# EAGLE design Adafruit Si5351A (EAGLE 6.2)
COMPANY: ADAFRUIT INDUSTRIES; DRAWN: KTOWN; REV: B
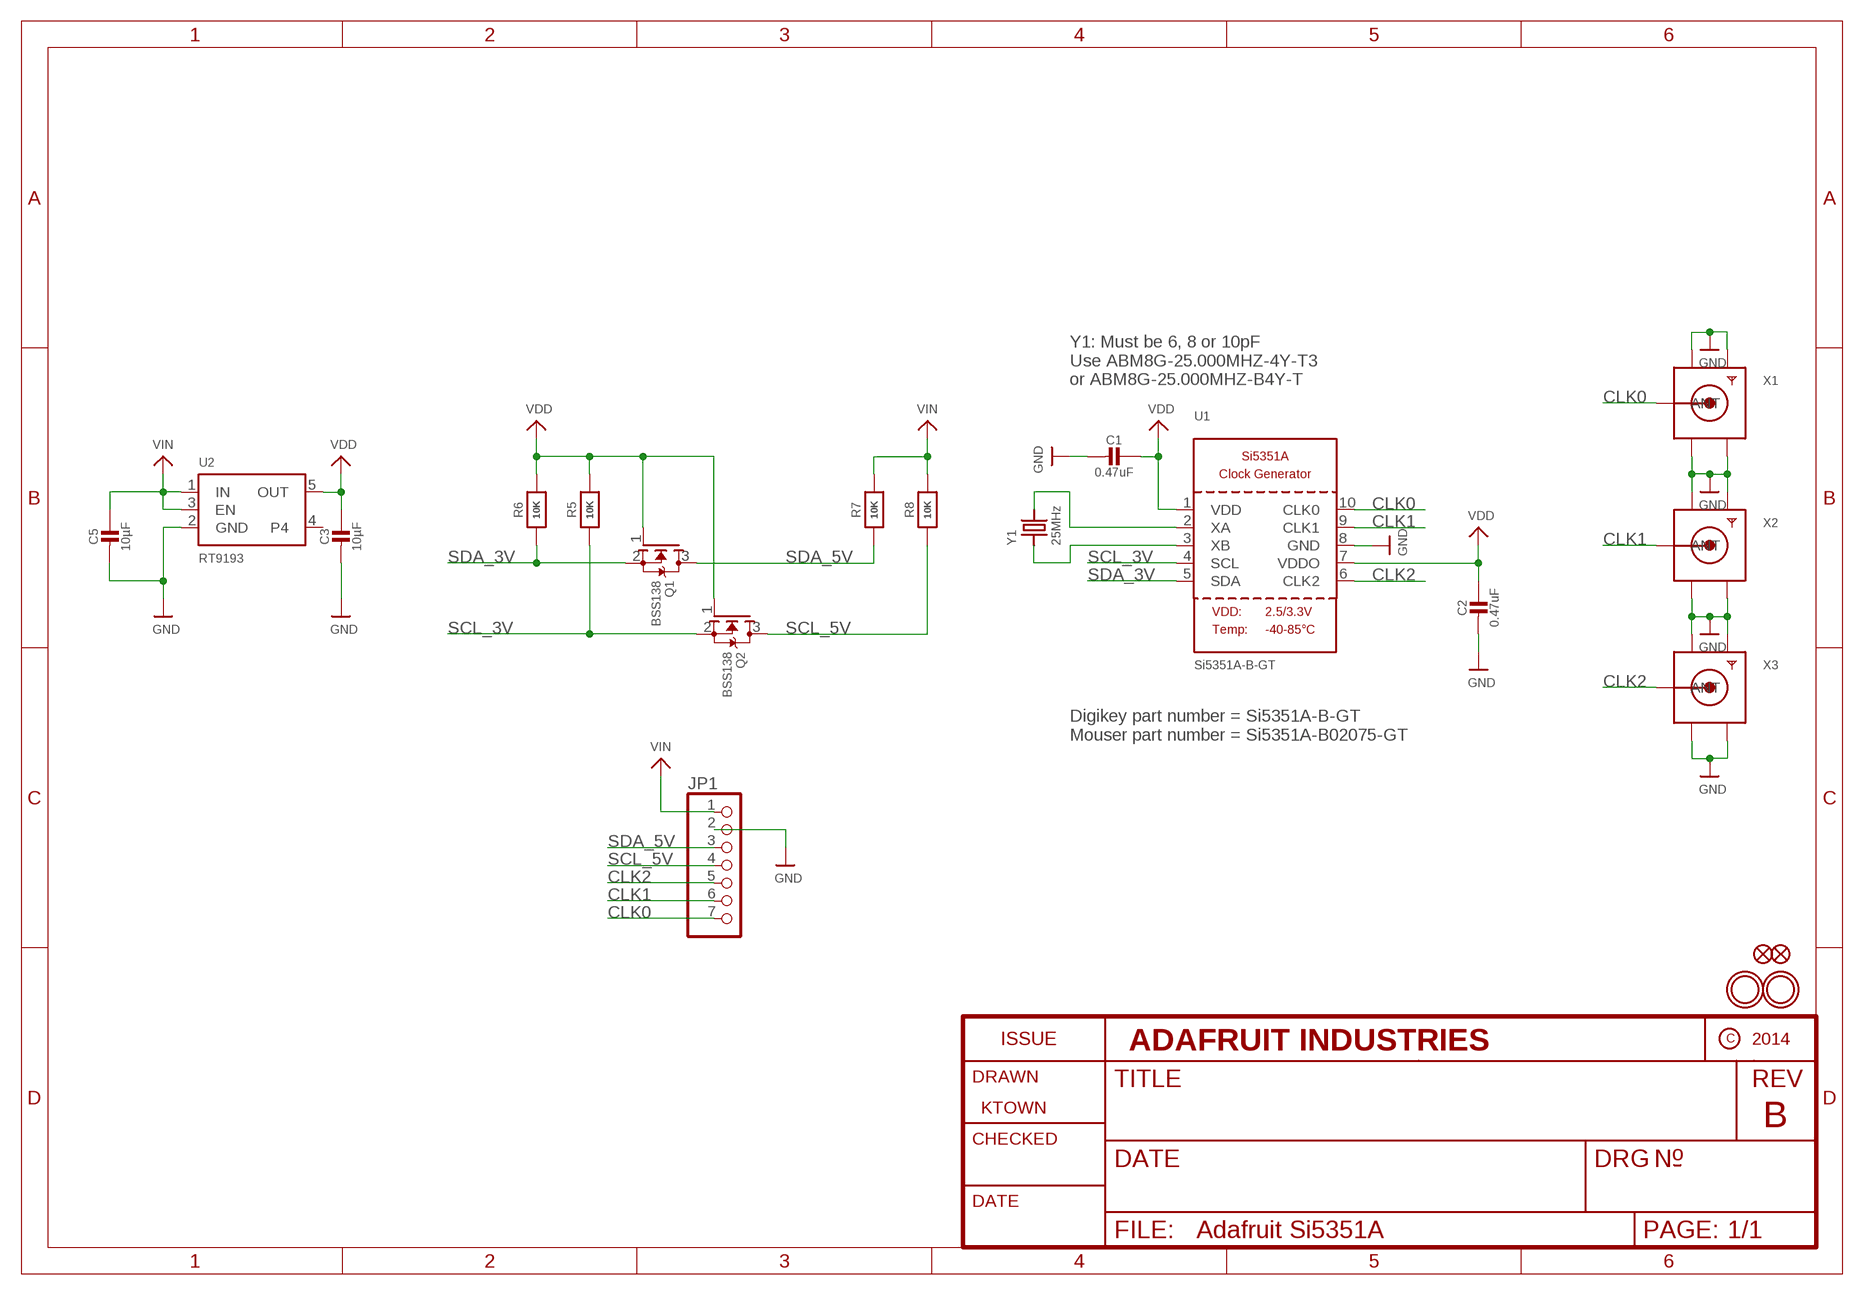
[diagram p0: schematic, sheet 1]

## Parts
C1  0.47uF  CAP_CERAMIC0805-NOOUTLINE  [0805-NO]
C2  0.47uF  CAP_CERAMIC0805-NOOUTLINE  [0805-NO]
C3  10µF  CAP_CERAMIC0805-NOOUTLINE  [0805-NO]
C5  10µF  CAP_CERAMIC0805-NOOUTLINE  [0805-NO]
FID1  FIDUCIAL""  [FIDUCIAL_1MM]
FID2  FIDUCIAL""  [FIDUCIAL_1MM]
JP1  HEADER-1X7THICKER  [1X07_ROUND_76]
Q1  BSS138  MOSFET-NWIDE  [SOT23-WIDE]
Q2  BSS138  MOSFET-NWIDE  [SOT23-WIDE]
R5  10K  RESISTOR0805_NOOUTLINE  [0805-NO]
R6  10K  RESISTOR0805_NOOUTLINE  [0805-NO]
R7  10K  RESISTOR0805_NOOUTLINE  [0805-NO]
R8  10K  RESISTOR0805_NOOUTLINE  [0805-NO]
U1  Si5351A-B-GT  SI5351A  [MSOP10]
U2  RT9193  VREG_SOT23-5  [SOT23-5]
U$10  MOUNTINGHOLE2.5  [MOUNTINGHOLE_2.5_PLATED]
U$11  MOUNTINGHOLE2.5  [MOUNTINGHOLE_2.5_PLATED]
X1  SMACONNECTOR_EDGE  [SMA_EDGELAUNCH]
X2  SMACONNECTOR_EDGE  [SMA_EDGELAUNCH]
X3  SMACONNECTOR_EDGE  [SMA_EDGELAUNCH]
Y1  25MHz  CRYSTAL3.2X2.5  [CRYSTAL_3.2X2.5]

## Nets
CLK0: JP1.7 U1.10(CLK0) X1.P(ANT)
CLK1: JP1.6 U1.9(CLK1) X2.P(ANT)
CLK2: JP1.5 U1.6(CLK2) X3.P(ANT)
GND: C1.2 C2.2 C3.2 C5.2 JP1.2 U1.8(GND) U2.2(GND) X1.GND@1(GND4) X1.GND@2(GND3) X1.GND@3(GND2) X1.GND@4(GND1) X2.GND@1(GND4) X2.GND@2(GND3) X2.GND@3(GND2) X2.GND@4(GND1) X3.GND@1(GND4) X3.GND@2(GND3) X3.GND@3(GND2) X3.GND@4(GND1)
N$1: U1.3(XB) Y1.1
N$2: U1.2(XA) Y1.2
SCL_3V: Q2.2(S) R5.1 U1.4(SCL)
SCL_5V: JP1.4 Q2.3(D) R8.1
SDA_3V: Q1.2(S) R6.1 U1.5(SDA)
SDA_5V: JP1.3 Q1.3(D) R7.1
VDD: C1.1 C2.1 C3.1 Q1.1(G) Q2.1(G) R5.2 R6.2 U1.1(VDD) U1.7(VDDO) U2.5(OUT)
VIN: C5.1 JP1.1 R7.2 R8.2 U2.1(IN) U2.3(EN)
Unconnected: U2.4

## Notes on the sheet
- Y1: Must be 6, 8 or 10pF
  Use ABM8G-25.000MHZ-4Y-T3
  or ABM8G-25.000MHZ-B4Y-T
- Digikey part number = Si5351A-B-GT
  Mouser part number = Si5351A-B02075-GT

## Library data of the parts
C1-C3 C5 = microbuilder:CAP_CERAMIC: Ceramic Capacitors For new designs, use the packages preceded by an '_' character since they are more reliable: The following footprints should be used on most boards: _0402 - Standard footprint for regular board layouts _0603 - Standard footprint for regular board layouts _0805 - Standard footprint for regular board layouts _1206 - Standard footprint for regular board layouts For extremely tight-pitch boards where space is at a premium, the following 'micro-pitch' footprints can be used (smaller pads, no silkscreen outline, etc.): _0402MP - Micro-pitch footprint for very dense/compact boards _0603MP - Micro-pitch footprint for very dense/compact boards _0805MP - Micro-pitch footprint for very dense/compact boards _1206MP - Micro-pitch footprint for very dense/compact boards
FID1 FID2 = microbuilder:FIDUCIAL: Fiducial Alignment Points Various fiducial points for machine vision alignment.; BOM: EXCLUDE
JP1 = microbuilder:HEADER-1X7: PIN HEADER
Q1 Q2 = microbuilder:MOSFET-N: N-Channel Mosfet LEGEND VDS: Voltage Drain-Source ID: Drain Current RDS(ON): Drain-Source On-State Resistance VGS(TH): Gate-Source Threshold Voltage CISS: Drain-Source Input Capacitance SOT-23 Name VDS ID RDS(ON) VGS(TH) CISS Order Number 2N7002E 60V 260mA 2.5 Ohm 2.5V @ 250uA 26.7pF @ 25V 2N7002ET1GOSTR-ND BSH103 30V 850mA 400 mOhm 400mV @ 1mA 83pF @ 24V BSH103,235-ND BSS138 60V 320mA 1.6 Ohm 1.5V @ 250uA 50pF @ 10V Mouser: 771-BSS138PW115 DMN2075U-7 20V 4.2A 38 mOhm 1V @ 250 uA 594.3pF @ 10V DMN2075U-7DICT-ND * BSS138 good choice for I2C level-shifting POWERPAK 1212-8 Name VDS ID RDS(ON) VGS(TH) CISS Order Number Si7308DN 60V 6A 58 mOhm 3V @ 250uA 665pF @ 15V SI7308DN-T1-E3CT-ND
R5-R8 = microbuilder:RESISTOR: Resistors For new designs, use the packages preceded by an '_' character since they are more reliable: The following footprints should be used on most boards: _0402 - Standard footprint for regular board layouts _0603 - Standard footprint for regular board layouts _0805 - Standard footprint for regular board layouts _1206 - Standard footprint for regular board layouts For extremely tight-pitch boards where space is at a premium, the following 'micro-pitch' footprints can be used (smaller pads, no silkscreen outline, etc.): _0402MP - Micro-pitch footprint for very dense/compact boards _0603MP - Micro-pitch footprint for very dense/compact boards _0805MP - Micro-pitch footprint for very dense/compact boards _1206MP - Micro-pitch footprint for very dense/compact boards
U1 = microbuilder:SI5351A: Si5351A 8kHz-160MHz I2C Clock Generator VDD: 2.5V or 3.3V Input Range: 25MHz or 27MHz XTAL User selectable internal input load capacitors: 6, 8 or 10 pF Output Impedance: 85 Ohm Output Load Capacitance: 5-15pF Operating Temperature: -40°C - 85°C Operating Current (3 outputs): 35mA Output buffer voltage (VDDO): 1.8, 2.5 or 3.3V Note: If VDDO is not used it should be connected to VDD. Unused clock out pins should be left floating.
U2 = microbuilder:VREG_SOT23-5: SOT23-5 Fixed Voltage Regulators Part Current Out V Out V In V Dropout θJA (°C/W) TJ (°C) Digikey Part No. ADP121 150mA 3.3V 3.4-5.5V 0.09V @ 150mA -- -- ADP121-AUJZ33R7CT-ND ADP121 150mA 3.0V 3.1-5.5V 0.09V @ 150mA -- -- ADP121-AUJZ30R7CT-ND ADP122 300mA 3.3V 3.4-5.5V 0.085V @ 300mA -- -- ADP122AUJZ-3.3-R7CT-ND ADP1712 300mA 3.3V 3.5-5.5V 0.17V @ 300mA -- -- ADP1712AUJZ-3.3-R7TR-ND AP7311 (Low Cost) 150mA 3.3V 3.5-6V 0.15V @ 150mA -- -- AP7311-33WG-7DICT-ND LD39015M18R 150mA 1.8V 1.9V-5.5V 0.08V @ 100mA -- -- 497-6977-1-ND LP2985A-33DBVR 150mA 3.3V 3.3-16V 0.28V @ 150mA 206 150 296-18479-1-ND MCP1824T-3302E/OT 300mA 3.3V 3.5V-6V 0.2V @ 300mA -- -- MCP1824T-3302E/OTCT-ND MIC5205-2.5YM5 TR 150mA 2.5V 2.7-16V 0.165V @ 150mA -- -- 576-1257-2-ND MIC5205-3.0YM5 TR 150mA 3.0V 3.2V-16V 0.165V @ 150mA -- -- 576-1258-2-ND MIC5205-3.3YM5 TR 150mA 3.3V 3.5V-16V 0.165V @ 150mA -- -- 576-1259-2-ND TPS780330220 150mA 3.3V+2.2V 3.6-5.5V 250mV Max -- -- 296-23332-1-ND TDA3663/N1,135 100mA 3.3V 3.5-45V 0.18V @ 50mA -- -- 568-5343-1-ND Max operating temp can be calculated using θJA, TJ (max junction temperature), and power in watts. Set the "Maximum Ambient Temperature" until it reaches TJ ("Max Junction Temperature"), which is the absolute limit for safe use of the regulator: Heat Sink Temperature Calculator <http://www.daycounter.com/Calculators/Heat-Sink-Temperature-Calculator.phtml> For example, With 12V source into a 3.3V LP2985 and a 30mA load, we are dissipating (12V-3.3V) * 0.03A = 0.261W. With a θJA of 206 °C/W, a TJ of 150°C, and 261mW we can safely use the chip without a heat sink up to 75°C (=147.1°C Junction Temperature).
U$10 U$11 = microbuilder:MOUNTINGHOLE: Mounting Hole For #2 screws (0.086"/2.18mm width, 0.094"/2.4mm hole) use 2.5mm; BOM: EXCLUDE
X1-X3 = microbuilder:SMACONNECTOR: SMA Connector 90° DIP SMA Connector, 50 Ohm (4UConnector: 07259)
Y1 = microbuilder:CRYSTAL: Crystals HC49UP - Surface Mount Crystal 4.0MHz 18pF +/-30ppm Surface Mount Crystal [Digikey: 535-9857-1-ND] 12.0 MHz Surface Mount Crystal [Digikey: 535-9869-6-ND] 25.0 MHz Surface Mount Crystal [Digikey: 535-9078-1-ND] 2.5 x 2.0mm - MEMs SMT Crystal 16.0 MHz 10pF 20ppm 2.5 x 2.0mm Crystal [Digikey -40-85°C: 535-10923-1-ND] 3.2 x 2.5mm - MEMs SMT Crystal 12.0 MHz 8pF 15ppm 3.2 x 2.5mm Crystal [Digikey: -10-70°C: 644-1047-1-ND -40-125°C: 644-1128-1-ND] 40~85°C cheaper: 644-1173-6-ND 16.0 MHz 8pF 15ppm 3.2 x 2.5mm Crystal [Digikey: -10-70°C: 644-1049-1-ND -40-125°C: 644-1129-2-ND]-40~85°C cheaper: 644-1175-6-ND 16.0 MHz 10pF 10ppm 3.2 x 2.5mm Crystal [Digikey: 644-1100-1-ND] 27.12 MHz 18pF 30ppm 3.2 x 2.5mm Crystal [Digikey: 887-1424-1-ND] 27.12MHz 10pF 10ppm 3.2 x 2.5mm Crystal [Digikey: 887-1329-1-ND] 4.9 x 1.8mm - MEMs SMT Crystal 32.768 KHz 12.5pF 20ppm 4.9 x 1.8mm Crystal [Digikey: SE2415CT-ND] 8.0 x 3.8mm - Surface Mount Crystal 32.768kHz 12.5pF 20ppm -40°C-85°C [Digikey: 535-9166-2-ND] Cylinder 32.768KHz Cylinder Crystal (2x6mm body) [Ex. Digikey: 300-8341-2-ND]

## Board
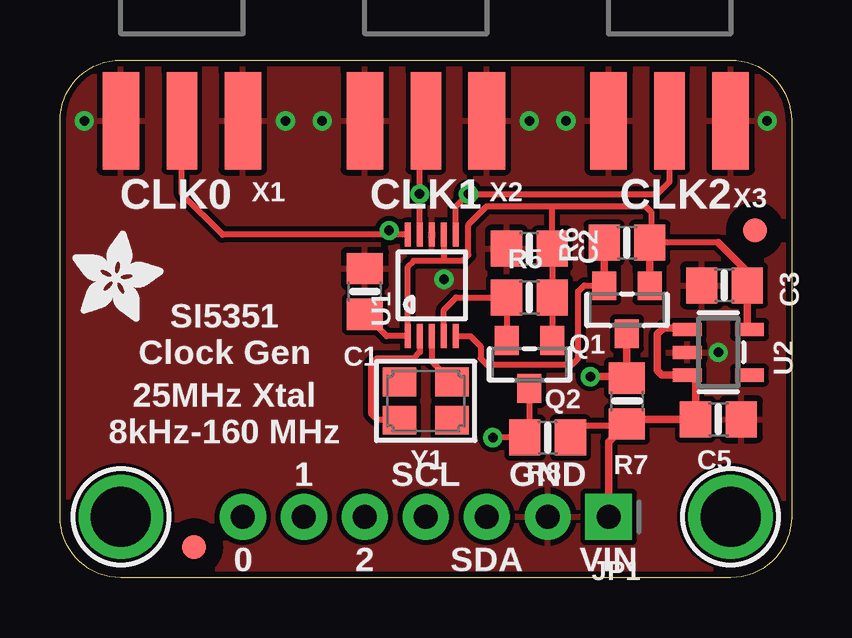
[diagram p1: board, top side]
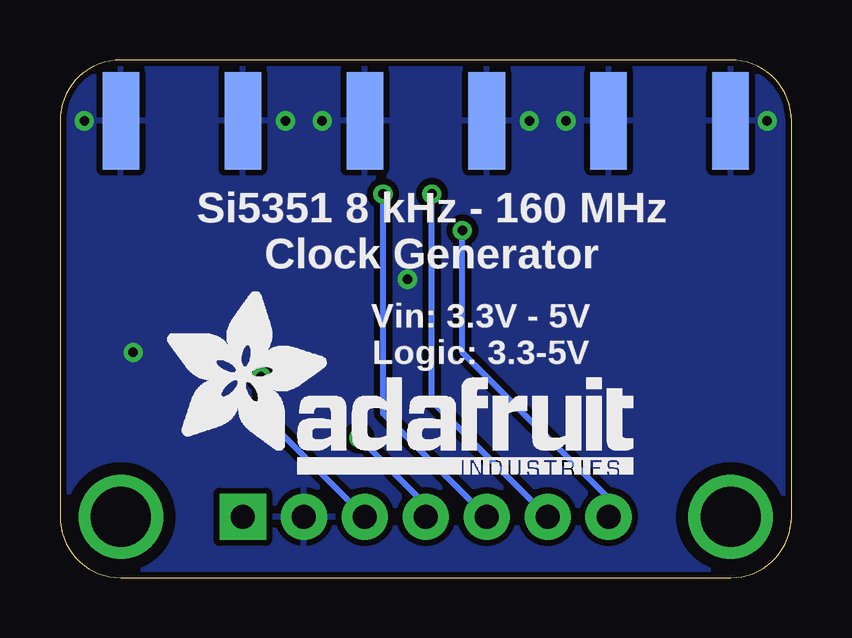
[diagram p2: board, bottom side, seen from below]

Size 30.48 x 21.59 mm. Coordinates in mm from the lower left corner, seen from the top.
Outline: 0,2.54 0,19.05 arc-90 2.54,21.59 27.94,21.59 arc-90 30.48,19.05 30.48,2.54 arc-90 27.94,0 2.54,0 arc-90 0,2.54
Copper layers (1*16): Top 0.035mm / dielectric 1.5mm / Bottom 0.035mm
Design rules: minimum track width 8mil, minimum drill 15.5mil, track to track 8mil, track to pad 8mil, pad to pad 8mil, via to via 8mil, smd to smd 8mil, copper to edge 10mil, drill to drill 8mil, minimum pad ring 10mil, minimum via ring 8mil, stop-mask expansion 2mil, vias tented up to drill 20mil, thermal gap 10mil

### Footprints (pad centres in the part's own frame; a part is rotated, then mirrored left to right if it is on the bottom)
0805-NO = smd 1.3 x 1.5: 1 -0.95,0; 2 0.95,0
FIDUCIAL_1MM = smd 1 x 1: 1 0,0
1X07_ROUND_76 = drill 1 pad 1.93 square: 1 -7.62,0 | drill 1 pad 1.93: 2 -5.08,0; 3 -2.54,0; 4 0,0; 5 2.54,0; 6 5.08,0; 7 7.62,0
SOT23-WIDE = smd 1 x 1.2: 1 -0.95,-1; 2 0.95,-1; 3 0,1
MSOP10 = smd 0.25 x 1: 1 -1,-2.113; 2 -0.5,-2.113; 3 0,-2.113; 4 0.5,-2.113; 5 1,-2.113; 6 1,2.113; 7 0.5,2.113; 8 0,2.113; 9 -0.5,2.113; 10 -1,2.113
SOT23-5 = smd 0.55 x 1.2: 1 -0.95,-1.3; 2 0,-1.3; 3 0.95,-1.3; 4 0.95,1.3; 5 -0.95,1.3
MOUNTINGHOLE_2.5_PLATED = drill 2.5 pad 3.2: P$1 0,0
SMA_EDGELAUNCH = smd 4.064 x 1.524: GND@1 2.032,-2.54; GND@2 2.032,2.54 | smd 4.064 x 1.524 bottom: GND@3 2.032,2.54; GND@4 2.032,-2.54 | smd 4.064 x 1.27: P 2.032,0
CRYSTAL_3.2X2.5 = smd 1.4 x 1.2: 1 -1.1,-0.8; 2 1.1,0.8; GND1 -1.1,0.8; GND2 1.1,-0.8

### Placement (x,y rotation side)
C1  12.7,11.94 90 top
C2  19.56,13.72 180 top
C3  27.69,12.19 180 top
C5  27.43,6.6 0 top
FID1  28.96,14.48 180 top
FID2  5.59,1.27 180 top
JP1  15.24,2.54 180 top
Q1  23.62,11.18 180 top
Q2  19.56,8.89 180 top
R5  19.56,11.68 0 top
R6  23.62,13.97 0 top
R7  23.62,7.37 270 top
R8  20.32,5.84 0 top
U1  15.49,12.19 0 top
U2  27.43,9.4 270 top
U$10  27.94,2.54 180 top
U$11  2.54,2.54 180 top
U$12  [ADAFRUIT_3.5MM]  0.51,10.67 0 top
U$23  [ADAFRUIT_TEXT_20MM]  26.16,4.32 0 bottom
X1  5.08,21.08 270 top
X2  15.24,21.08 270 top
X3  25.4,21.08 270 top
Y1  15.24,7.37 180 top

### Tracks (layer width: path | path; a pad name or v marks a point on that pad's centre or on a via)
CLK0  (via drill 0.39)
  Top 0.254: U1.10 13.46,14.3 | 13.46,14.3 6.78,14.3 5.08,16 X1.P | v13.72,14.48 13.46,14.48 13.46,14.3
  Bottom 0.254: v13.72,14.48 13.72,9.4 7.62,3.3 JP1.7
CLK1  (via drill 0.39)
  Top 0.254: U1.9 14.99,16.26 | 14.99,16.26 14.99,18.8 X2.P | v14.99,16 14.99,16.26
  Bottom 0.254: v14.99,16 14.99,7.37 JP1.6
CLK2  (via drill 0.39)
  Top 0.254: U1.6 16.49,15.48 v17.02,16 24.89,16 25.4,16.51 X3.P
  Bottom 0.254: v17.02,16 17.02,6.86 JP1.5
GND  (via drill 0.39)
  other vias: 29.46,19.05 21.08,19.05 19.56,19.05 10.92,19.05 9.4,19.05 1.02,19.05 27.43,9.4 16,12.45
  pour Top (isolate 0.203): 30.48,0 -0.25,0 -0.51,21.59 30.48,21.59
  pour Bottom (isolate 0.254): 30.48,0 -0.25,0 -0.25,21.59 30.48,21.59
N$1
  Top 0.254: U1.3 15.49,9.01 Y1.1
N$2
  Top 0.254: U1.2 14.99,9.41 14.73,9.14 13.21,9.14 12.95,8.89 12.95,6.86 13.21,6.6 14.1,6.6 Y1.2
SCL_3V
  Top 0.254: Q2.2 R5.1 16.51,11.68 15.99,11.17 U1.4
SCL_5V  (via drill 0.39)
  Top 0.254: v18.03,5.84 R8.1 19.56,6.03 Q2.3
  Bottom 0.254: JP1.4 15.24,3.05 v18.03,5.84
SDA_3V
  Top 0.254: U1.5 17.1,10.08 17.53,9.65 17.53,9.14 17.78,8.89 21.34,8.89 21.59,9.14 21.59,11.94 21.84,12.19 22.66,12.19 Q1.2
  Top 0.305: R6.1 Q1.2
SDA_5V  (via drill 0.39)
  Top 0.305: Q1.3 R7.1 23.56,8.38 v22.1,8.38
  Bottom 0.254: JP1.3 22.1,6.86 v22.1,8.38
VDD
  Top 0.254: Q2.1 R5.2 C2.1 20.51,15.43 20.57,15.49 | 20.57,15.49 17.78,15.49 17.02,14.73 17.02,13.46 16.76,13.21 16,13.21 | 20.57,15.49 24.38,15.49 24.64,15.24 24.64,14.04 R6.2 27.43,13.97 | U1.7 15.99,13.22 16,13.21 | 16,13.21 14.73,13.21 14.48,12.95 14.48,10.1 U1.1 13.61,10.08 C1.1
  Top 0.305: R6.2 Q1.1 | U2.5 28.64,10.35 C3.1 28.64,12.77 27.43,13.97
VIN
  Top 0.254: R8.2 21.34,5.84 21.84,6.35 23.56,6.35 R7.2
  Top 0.305: U2.1 26.07,10.41 25.15,10.41 24.89,10.16 24.89,8.64 25.08,8.45 U2.3 26.48,8.45 C5.1 23.81,6.6 R7.2 22.86,5.65 JP1.1

### Text on the board
tPlace: CLK0 | CLK1 | CLK2 | SI5351 / Clock Gen | 25MHz Xtal / 8kHz-160 MHz | 1 | SCL | GND | 0 | 2 | SDA | VIN
bPlace: Si5351 8 kHz - 160 MHz / Clock Generator | Vin: 3.3V - 5V / Logic: 3.3-5V